# EAGLE design msp430g2553_controller_breadboard_kits (EAGLE 7.7.0)
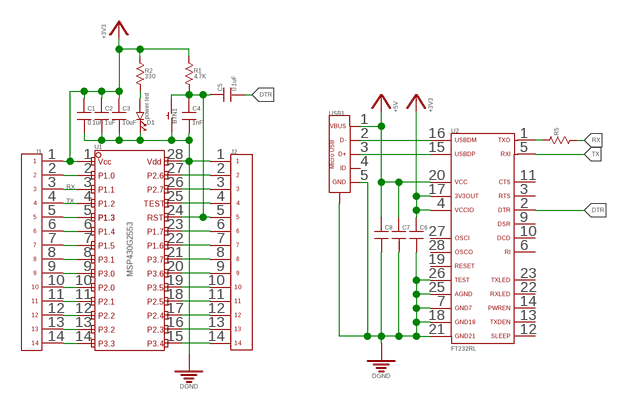
[diagram p0: schematic, sheet 1]

## Parts
BTN1  BTN_NORMAL_OFF_6_3.5_SMD  [BTN_6_3.5_SMD]
C1  0.1uF  CAPACITOR_FIXED_0805  [0805]
C2  1uF  CAPACITOR_FIXED_0805  [0805]
C3  10uF  CAPACITOR_FIXED_0805  [0805]
C4  1nF  CAPACITOR_FIXED_0805  [0805]
C5  0.1uF  CAPACITOR_FIXED_0805  [0805]
C6  CAPACITOR_FIXED_0805  [0805]
C7  CAPACITOR_FIXED_0805  [0805]
C8  CAPACITOR_FIXED_0805  [0805]
D1  power led  LED-0805  [0805DIODE]
J1  14PIN_HEADER_PITCH2.54MM_TH  [14PIN_HEADER_PITCH2.54MM_TH]
J2  14PIN_HEADER_PITCH2.54MM_TH  [14PIN_HEADER_PITCH2.54MM_TH]
R1  4.7K  RESISTOR_0805  [0805]
R2  330  RESISTOR_0805  [0805]
R5  RESISTOR_0805  [0805]
U1  MSP430G2553_24IO_28PIN_TSSOP  [TSSOP-28]
U2  FT232RL_SSOP28  [SSOP-28]
USB1  USB-2.0-MICRO_SMD_SMD  [MICRO-USB-B-SMD-SMD]

## Nets
+3V3: C1.1 C2.1 C3.1 C6.1 J1.1 R1.1 R2.1 U1.1 U2.4 U2.17
+5V: C7.1 C8.1 U2.20 USB1.1(VBUS)
DGND: BTN1.1 C1.2 C2.2 C3.2 C4.2 C6.2 C7.2 C8.2 D1.1(K) J2.1 U1.28 U2.7 U2.18 U2.21 U2.25 U2.26 USB1.5(GND) USB1.S1(SHIELD) USB1.S2(SHIELD)
DTR: C5.2 U2.2
N$2: D1.2(A) R2.2
P1.0: J1.2 U1.2
P1.3: J1.5 U1.5
P1.4: J1.6 U1.6
P1.5: J1.7 U1.7
P1.7: J2.6 U1.23
P2.0: J1.10 U1.10
P2.1: J1.11 U1.11
P2.2: J1.12 U1.12
P2.3: J2.13 U1.16
P2.4: J2.12 U1.17
P2.5: J2.11 U1.18
P2.6: J2.2 U1.27
P2.7: J2.3 U1.26
P3.0: J1.9 U1.9
P3.1: J1.8 U1.8
P3.2: J1.13 U1.13
P3.3: J1.14 U1.14
P3.4: J2.14 U1.15
P3.5: J2.10 U1.19
P3.6: J2.9 U1.20
P3.7: J2.8 U1.21
P`.6: J2.7 U1.22
RST: BTN1.2 C4.1 C5.1 J2.5 R1.2 U1.24
RX: J1.3 R5.2 U1.3
TEST: J2.4 U1.25
TX: J1.4 U1.4 U2.5
TXO: R5.1 U2.1
USBDM: U2.16 USB1.2(D-)
USBDP: U2.15 USB1.3(D+)
Unconnected: U2.3 U2.6 U2.9 U2.10 U2.11 U2.12 U2.13 U2.14 U2.19 U2.22 U2.23 U2.27 U2.28 USB1.4(ID)

## Library data of the parts
BTN1 = Switches:BTN_NORMAL_OFF
C1-C8 = Capacitors:CAPACITOR_FIXED
D1 = LEDs:LED
J1 J2 = Connectors:14PIN
R1 R2 R5 = Resistors:RESISTOR
U1 = MCUs:MSP430G2553_24IO_28PIN
U2 = FTDI:FT232RL
USB1 = Connectors:USB-2.0-MICRO

## Board
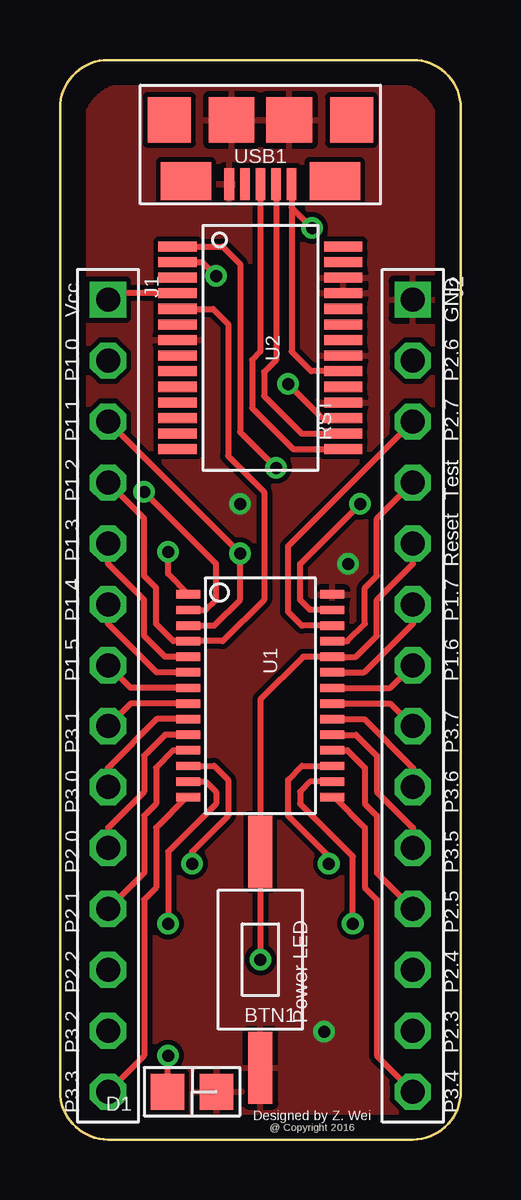
[diagram p1: board, top side]
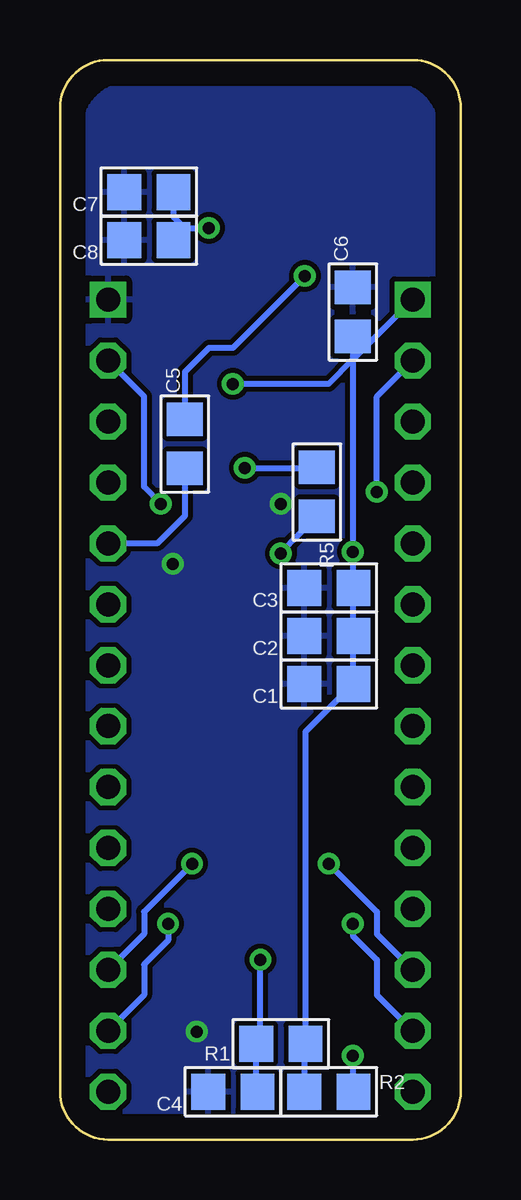
[diagram p2: board, bottom side, seen from below]

Size 16.7 x 45 mm. Coordinates in mm from the lower left corner, seen from the top.
Outline: 0,43 0,2 arc90 2,0 14.7,0 arc90 16.7,2 16.7,43 arc90 14.7,45 2,45 arc90 0,43
Copper layers (1*16): Top 0.035mm / dielectric 1.5mm / Bottom 0.035mm
Design rules "default": minimum track width 10mil, minimum drill 24mil, track to track 8mil, track to pad 8mil, pad to pad 8mil, via to via 8mil, smd to smd 8mil, copper to edge 40mil, drill to drill 8mil, minimum pad ring 10mil, minimum via ring 8mil, stop-mask expansion 4mil, vias tented up to drill 0mil, thermal gap 10mil

### Footprints (pad centres in the part's own frame; a part is rotated, then mirrored left to right if it is on the bottom)
BTN_6_3.5_SMD = smd 1 x 3: 1 0,4.5; 2 0,-4.5
0805 = smd 1.4 x 1.5: 1 -1.025,0; 2 1.025,0
0805DIODE = smd 1.4 x 1.5: 1 -1.025,0; 2 1.025,0
14PIN_HEADER_PITCH2.54MM_TH = drill 1 square: 1 -16.51,0 | drill 1 octagon: 2 -13.97,0; 3 -11.43,0; 4 -8.89,0; 5 -6.35,0; 6 -3.81,0; 7 -1.27,0; 8 1.27,0; 9 3.81,0; 10 6.35,0; 11 8.89,0; 12 11.43,0; 13 13.97,0; 14 16.51,0
TSSOP-28 = smd 0.35 x 1: 1 -4.225,-3; 2 -3.575,-3; 3 -2.925,-3; 4 -2.275,-3; 5 -1.625,-3; 6 -0.975,-3; 7 -0.325,-3; 8 0.325,-3; 9 0.975,-3; 10 1.625,-3; 11 2.275,-3; 12 2.925,-3; 13 3.575,-3; 14 4.225,-3; 15 4.225,3; 16 3.575,3; 17 2.925,3; 18 2.275,3; 19 1.625,3; 20 0.975,3; 21 0.325,3; 22 -0.325,3; 23 -0.975,3; 24 -1.625,3; 25 -2.275,3; 26 -2.925,3; 27 -3.575,3; 28 -4.225,3
SSOP-28 = smd 0.42 x 1.6: 1 -4.225,-3.45; 2 -3.575,-3.45; 3 -2.925,-3.45; 4 -2.275,-3.45; 5 -1.625,-3.45; 6 -0.975,-3.45; 7 -0.325,-3.45; 8 0.325,-3.45; 9 0.975,-3.45; 10 1.625,-3.45; 11 2.275,-3.45; 12 2.925,-3.45; 13 3.575,-3.45; 14 4.225,-3.45; 15 4.225,3.45; 16 3.575,3.45; 17 2.925,3.45; 18 2.275,3.45; 19 1.625,3.45; 20 0.975,3.45; 21 0.325,3.45; 22 -0.325,3.45; 23 -0.975,3.45; 24 -1.625,3.45; 25 -2.275,3.45; 26 -2.925,3.45; 27 -3.575,3.45; 28 -4.225,3.45
MICRO-USB-B-SMD-SMD = smd 0.4 x 1.35: 1 -1.3,2.675; 2 -0.65,2.675; 3 0,2.675; 4 0.65,2.675; 5 1.3,2.675 | smd 2.1 x 1.6: M1 -3.1,2.55; M2 3.1,2.55 | smd 1.8 x 1.9: M3 -3.8,0; M4 3.8,0 | smd 1.9 x 1.9: S1 -1.2,0; S2 1.2,0

### Placement (x,y rotation side)
BTN1  8.35,7.5 180 top
C1  5.5,19 180 bottom
C2  5.5,21 180 bottom
C3  5.5,23 180 bottom
C4  9.5,2 180 bottom
C5  11.5,29 90 bottom
C6  4.5,34.5 90 bottom
C7  13,39.5 180 bottom
C8  13,37.5 180 bottom
D1  5.5,2 180 top
J1  2,18.5 270 top
J2  14.7,18.5 270 top
R1  7.5,4 180 bottom
R2  5.5,2 0 bottom
R5  6,27 270 bottom
U1  8.35,18.5 270 top
U2  8.35,33 270 top
USB1  8.35,42.5 180 top

### Tracks (layer width: path | path; a pad name or v marks a point on that pad's centre or on a via)
+3V3  (via drill 0.5)
  Top 0.254: U1.1 4.5,23.57 v4.5,24.5 | U2.4 2.27,35.27 J1.1 | U2.17 10.93,30.07 v9.5,31.5
  Bottom 0.254: R2.1 6.53,3.95 R1.1 6.47,17 C1.1 C2.1 C3.1 4.5,23.02 v4.5,24.5 4.5,32.51 | J1.1 4.5,32.51 | C6.1 4.5,32.51 | 4.5,32.51 5.51,31.5 v9.5,31.5
+5V  (via drill 0.5)
  Top 0.254: U2.20 10.47,32.02 9.65,32.85 9.65,38.85 | USB1.1 9.65,38.85 | v10.5,38 9.65,38.85
  Bottom 0.254: C7.1 11.97,38.48 11.5,38 | 11.5,38 v10.5,38 | C8.1 11.97,37.52 11.5,38
DGND  (via drill 0.5)
  other vias: 12,24 11,4.5 7.5,26.5
  pour Bottom: 15.7,42 15.7,3 arc-90 13.7,1 3,1 arc-90 1,3 1,42 arc-90 3,44 13.7,44 arc-90
  pour Top: 15.7,42 15.7,3 arc-90 13.7,1 3,1 arc-90 1,3 1,42 arc-90 3,44 13.7,44 arc-90
DTR  (via drill 0.5)
  Top 0.254: U2.2 5.92,36.58 v6.5,36
  Bottom 0.254: v6.5,36 9.5,33 10.5,33 11.5,32 C5.2
N$2  (via drill 0.5)
  Top 0.254: v4.5,3.5 4.47,3.48 D1.2
  Bottom 0.254: D1.2 4.47,3.48 v4.5,3.5
P1.0  (via drill 0.5)
  Top 0.254: U1.2 6.08,22.07 6.5,22.5 6.5,24 v3.5,27
  Bottom 0.254: v3.5,27 3.5,30.97 J1.2
P1.3
  Top 0.254: U1.5 4.38,20.12 3.5,21 3.5,22.5 2,24 J1.5
P1.4
  Top 0.254: U1.6 4.03,19.48 2,21.5 J1.6
P1.5
  Top 0.254: U1.7 2.94,18.82 J1.7
P1.7
  Top 0.254: U1.23 12.68,19.48 14.7,21.5 J2.6
P2.0
  Top 0.254: U1.10 4.38,16.88 3.5,16 3.5,14.5 2,13 J1.10
P2.1
  Top 0.254: U1.11 4.72,16.23 4,15.5 4,14 3.5,13.5 3.5,11.11 J1.11
P2.2  (via drill 0.5)
  Top 0.254: U1.12 6.42,15.57 7,15 7,13.5 5.5,12 v5.5,11.5
  Bottom 0.254: v5.5,11.5 3.5,9.5 3.5,8.57 J1.12
P2.3  (via drill 0.5)
  Top 0.254: U1.16 10.43,14.93 10,14.5 10,14 12.2,11.8 v12.2,9
  Bottom 0.254: v12.2,9 12.2,8.3 13.2,7.3 13.2,6.03 J2.13
P2.4  (via drill 0.5)
  Top 0.254: v11.2,11.5 11.2,11.8 9.5,13.5 9.5,15 10.07,15.57 U1.17
  Bottom 0.254: v11.2,11.5 13.2,9.5 13.2,8.57 J2.12
P2.5
  Top 0.254: U1.18 11.97,16.23 12.7,15.5 12.7,14 13.2,13.5 13.2,11.11 J2.11
P2.6  (via drill 0.5)
  Top 0.254: U1.27 10.43,22.07 10,22.5 10,24 v12.5,26.5
  Bottom 0.254: v12.5,26.5 13.2,27.2 13.2,30.97 J2.2
P2.7
  Top 0.254: U1.26 10.07,21.43 9.5,22 9.5,24.73 J2.3
P3.0
  Top 0.254: U1.9 4.03,17.52 2,15.5 J1.9
P3.1
  Top 0.254: U1.8 2.94,18.18 J1.8
P3.2  (via drill 0.5)
  Top 0.254: U1.13 6.08,14.93 6.5,14.5 6.5,14 4.5,12 v4.5,9
  Bottom 0.254: v4.5,9 4.5,8.5 3.5,7.5 3.5,6.03 J1.13
P3.3
  Top 0.254: U1.14 5.28,14.28 4,13 4,10.5 3.5,10 3.5,3.49 J1.14
P3.4
  Top 0.254: U1.15 11.43,14.28 12.7,13 12.7,10.5 13.2,10 13.2,3.49 J2.14
P3.5
  Top 0.254: U1.19 12.32,16.88 13.2,16 13.2,14.5 14.7,13 J2.10
P3.6
  Top 0.254: U1.20 12.68,17.52 14.7,15.5 J2.9
P3.7
  Top 0.254: U1.21 13.76,18.18 J2.8
P`.6
  Top 0.254: U1.22 13.76,18.82 J2.7
RST  (via drill 0.5)
  Top 0.254: J2.5 14.7,24 13.2,22.5 13.2,21 12.32,20.12 U1.24 10.12,20.12 8.35,18.35 BTN1.2 v8.35,7.5
  Bottom 0.254: C4.1 8.53,2.05 R1.2 8.35,4.17 v8.35,7.5 | C5.1 11.5,26 12.65,24.85 J2.5
RX  (via drill 0.5)
  Top 0.254: U1.3 6.42,21.43 7.5,22.5 v7.5,24.43 J1.3
  Bottom 0.254: R5.2 7,24.98 v7.5,24.43
TEST
  Top 0.254: U1.25 11.97,20.77 12.7,21.5 12.7,23 13.2,23.5 13.2,25.89 J2.4
TX
  Top 0.254: J1.4 3.5,25.89 3.5,23.5 4,23 4,21.5 4.72,20.77 U1.4 6.78,20.77 8.5,22.5 8.5,27 7,28.5 7,34 6.38,34.62 U2.5
TXO  (via drill 0.5)
  Top 0.254: U2.1 6.78,37.23 7.5,36.5 7.5,29.5 v9,28
  Bottom 0.254: v9,28 6.03,28 R5.1
USBDM
  Top 0.254: U2.16 10.07,29.43 8.5,31 8.5,32 9,32.5 USB1.2
USBDP
  Top 0.254: U2.15 9.72,28.77 8,30.5 8,32.5 8.35,32.85 USB1.3

### Text on the board
tPlace: Vcc | GND | P1.0 | P2.6 | P1.1 | RST | P2.7 | P1.2 | Test | P1.3 | Reset | P1.4 | P1.7 | P1.5 | P1.6 | P3.1 | P3.7 | P3.0 | P3.6 | P2.0 | P3.5 | P2.1 | P2.5 | P2.2 | Power LED | P2.4 | P3.2 | P2.3 | P3.3 | P3.4 | Designed by Z. Wei | @ Copyright 2016